# Altium schematic sheet 02_B_TO_B_CON.SchDoc
size A3
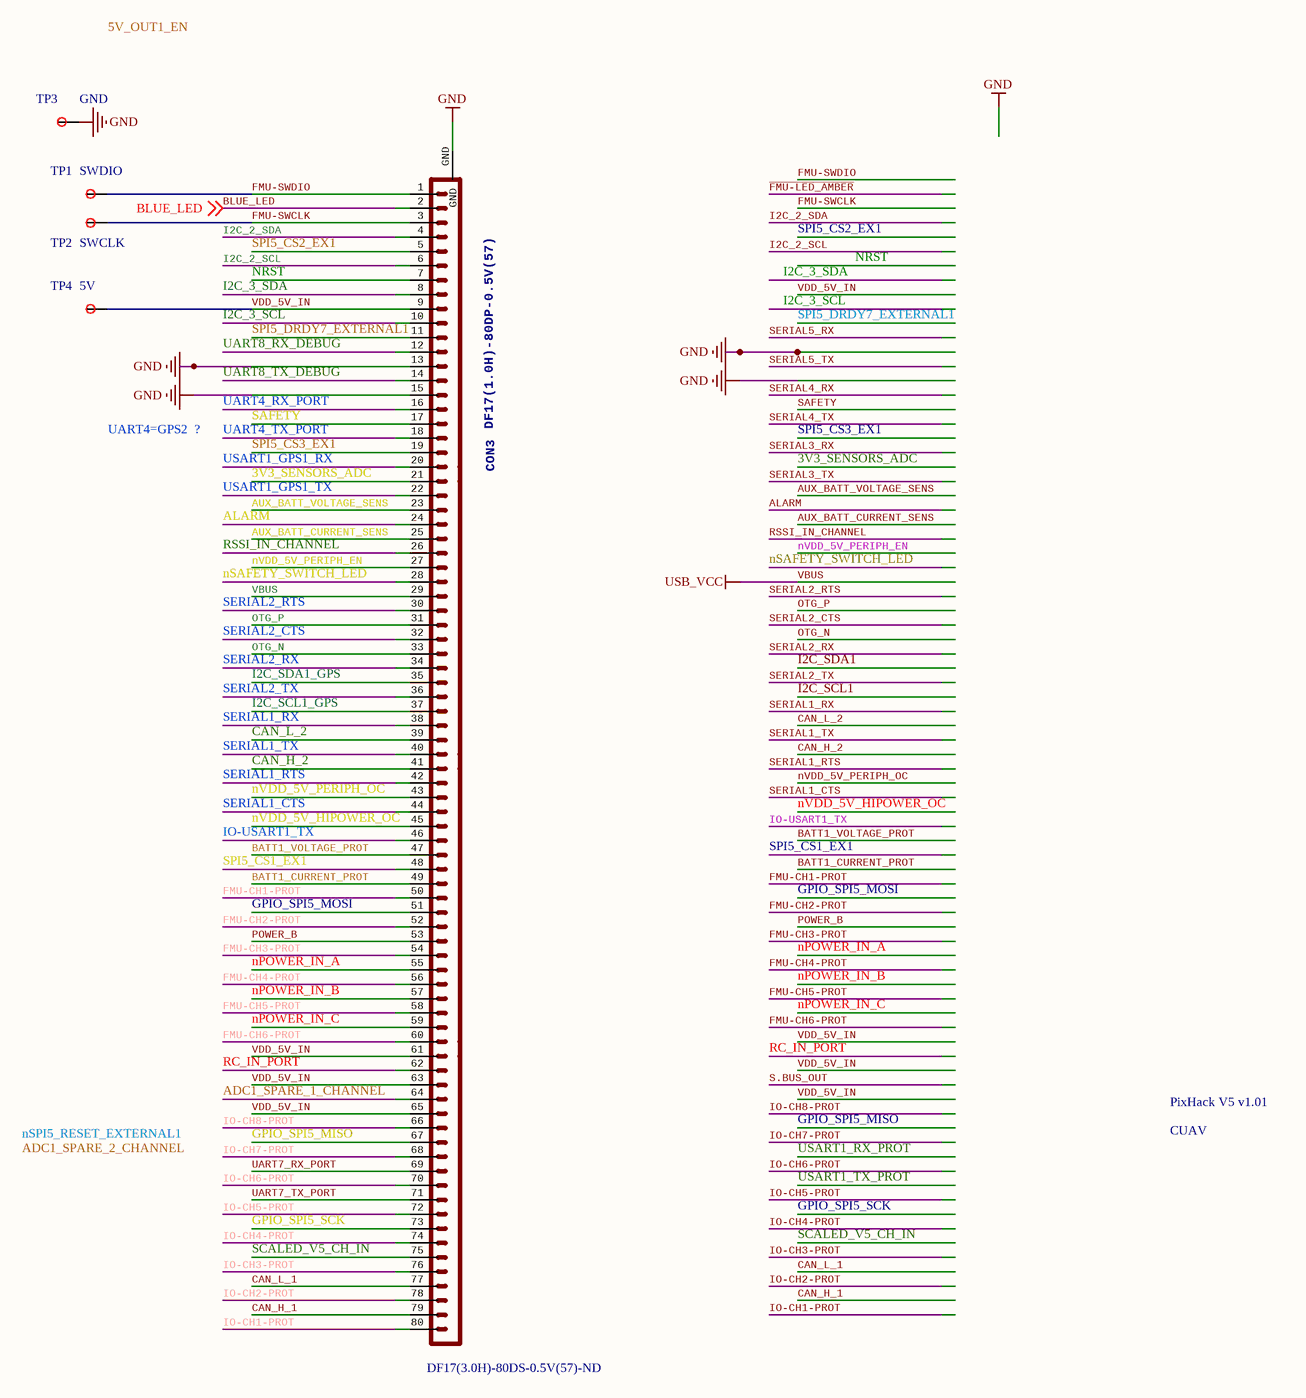
[diagram p0: 02_B_TO_B_CON.SchDoc]

## Parts
CON3  DF17(1.0H)-80DP-0.5V(57)  Supplier Part Number 1: DF17(3.0H)-80DS-0.5V(57)-ND  [DF17(1.0H)-80DP-0.5V(57)]
PixHack_V5_v1.01  CUAV  [CUAV]
TP1  SWDIO  [TP0.75]
TP2  SWCLK  [TP0.75]
TP3  GND  [TP0.75]
TP4  5V  [TP0.75]

## Nets
GND: CON3.13 CON3.15 CON3.GND TP3.0
VBUS: CON3.29  [also labelled USB_VCC]
3V3_SENSORS_ADC: CON3.21
ADC1_SPARE_1_CHANNEL: CON3.64
ALARM: CON3.24
AUX_BATT_CURRENT_SENS: CON3.25
AUX_BATT_VOLTAGE_SENS: CON3.23
BATT1_CURRENT_PROT: CON3.49
BATT1_VOLTAGE_PROT: CON3.47
BLUE_LED: CON3.2 ; off-sheet BLUE_LED
CAN_H_1: CON3.79
CAN_H_2: CON3.41
CAN_L_1: CON3.77
CAN_L_2: CON3.39
FMU-CH1-PROT: CON3.50
FMU-CH2-PROT: CON3.52
FMU-CH3-PROT: CON3.54
FMU-CH4-PROT: CON3.56
FMU-CH5-PROT: CON3.58
FMU-CH6-PROT: CON3.60
FMU-SWCLK: CON3.3 TP2.0
FMU-SWDIO: CON3.1 TP1.0
GPIO_SPI5_MISO: CON3.67
GPIO_SPI5_MOSI: CON3.51
GPIO_SPI5_SCK: CON3.73
I2C_2_SCL: CON3.6
I2C_2_SDA: CON3.4
I2C_3_SCL: CON3.10
I2C_3_SDA: CON3.8
I2C_SCL1_GPS: CON3.37
I2C_SDA1_GPS: CON3.35
IO-CH1-PROT: CON3.80
IO-CH2-PROT: CON3.78
IO-CH3-PROT: CON3.76
IO-CH4-PROT: CON3.74
IO-CH5-PROT: CON3.72
IO-CH6-PROT: CON3.70
IO-CH7-PROT: CON3.68
IO-CH8-PROT: CON3.66
IO-USART1_TX: CON3.46
nPOWER_IN_A: CON3.55
nPOWER_IN_B: CON3.57
nPOWER_IN_C: CON3.59
NRST: CON3.7
nSAFETY_SWITCH_LED: CON3.28
nVDD_5V_HIPOWER_OC: CON3.45
nVDD_5V_PERIPH_EN: CON3.27
nVDD_5V_PERIPH_OC: CON3.43
OTG_N: CON3.33
OTG_P: CON3.31
POWER_B: CON3.53
RC_IN_PORT: CON3.62
RSSI_IN_CHANNEL: CON3.26
SAFETY: CON3.17
SCALED_V5_CH_IN: CON3.75
SERIAL1_CTS: CON3.44
SERIAL1_RTS: CON3.42
SERIAL1_RX: CON3.38
SERIAL1_TX: CON3.40
SERIAL2_CTS: CON3.32
SERIAL2_RTS: CON3.30
SERIAL2_RX: CON3.34
SERIAL2_TX: CON3.36
SPI5_CS1_EX1: CON3.48
SPI5_CS2_EX1: CON3.5
SPI5_CS3_EX1: CON3.19
SPI5_DRDY7_EXTERNAL1: CON3.11
UART4_RX_PORT: CON3.16
UART4_TX_PORT: CON3.18
UART7_RX_PORT: CON3.69
UART7_TX_PORT: CON3.71
UART8_RX_DEBUG: CON3.12
UART8_TX_DEBUG: CON3.14
USART1_GPS1_RX: CON3.20
USART1_GPS1_TX: CON3.22
VDD_5V_IN: CON3.9 CON3.61 CON3.63 CON3.65 TP4.0

## Notes on the sheet
- Labels drawn without touching a wire or pin: 5V_OUT1_EN, ADC1_SPARE_2_CHANNEL, nSPI5_RESET_EXTERNAL1, UART4=GPS2  ?

## Library data of the parts
CON3 = CON-DF17-80F: CONN RECEPT 80POS .5MM SMD W/FIT; 3DR_PARTNO: ECM0518; PARTNO: DF17(3.0H)-80DS-0.5V(57); Supplier 1: Digi-Key
TP1-TP4 = TP_0.75: TP_0.75MM